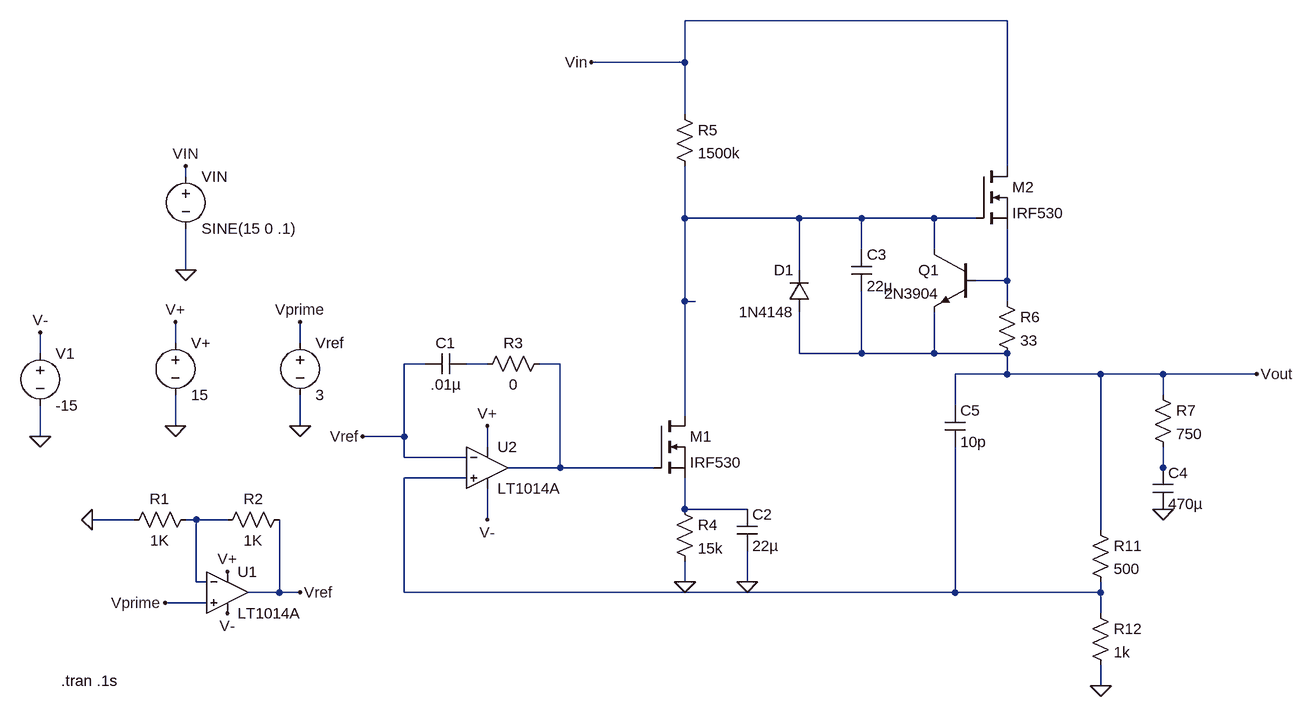
[diagram p0: schematic vregp.asc]
vregp.asc, the LTspice schematic file:
Version 4
SHEET 1 1328 1016
WIRE 816 -208 320 -208
WIRE 320 -144 320 -208
WIRE 320 -144 176 -144
WIRE 320 -64 320 -144
WIRE 816 16 816 -208
WIRE -448 32 -448 16
WIRE 320 96 320 16
WIRE 496 96 320 96
WIRE 592 96 496 96
WIRE 704 96 592 96
WIRE 768 96 704 96
WIRE 592 144 592 96
WIRE 704 144 704 96
WIRE -448 176 -448 112
WIRE 496 176 496 96
WIRE 816 192 816 112
WIRE 816 192 768 192
WIRE 320 224 320 96
WIRE 336 224 320 224
WIRE 816 224 816 192
WIRE -464 288 -464 256
WIRE -272 288 -272 256
WIRE -672 304 -672 272
WIRE 496 304 496 240
WIRE 592 304 592 208
WIRE 592 304 496 304
WIRE 704 304 704 240
WIRE 704 304 592 304
WIRE 816 304 704 304
WIRE -80 320 -112 320
WIRE 16 320 -16 320
WIRE 128 320 96 320
WIRE 816 336 816 304
WIRE 816 336 736 336
WIRE 960 336 816 336
WIRE 1056 336 960 336
WIRE 1200 336 1056 336
WIRE 1056 368 1056 336
WIRE 736 384 736 336
WIRE 320 400 320 224
WIRE -464 416 -464 368
WIRE -272 416 -272 368
WIRE -672 432 -672 384
WIRE -112 432 -112 320
WIRE -112 432 -176 432
WIRE 16 448 16 416
WIRE -112 464 -112 432
WIRE -16 464 -112 464
WIRE 128 480 128 320
WIRE 128 480 48 480
WIRE 272 480 128 480
WIRE 1056 480 1056 448
WIRE -16 496 -112 496
WIRE 1056 496 1056 480
WIRE 320 544 320 496
WIRE 416 544 320 544
WIRE -528 560 -592 560
WIRE -432 560 -448 560
WIRE -384 560 -432 560
WIRE 16 560 16 512
WIRE 960 576 960 336
WIRE -432 656 -432 560
WIRE -416 656 -432 656
WIRE 320 656 320 624
WIRE 416 656 416 608
WIRE -304 672 -304 560
WIRE -304 672 -352 672
WIRE -272 672 -304 672
WIRE -112 672 -112 496
WIRE 736 672 736 448
WIRE 736 672 -112 672
WIRE 960 672 960 656
WIRE 960 672 736 672
WIRE -416 688 -480 688
WIRE 960 704 960 672
WIRE 960 816 960 784
FLAG -464 416 0
FLAG -464 256 V+
FLAG -272 256 Vprime
FLAG -272 416 0
FLAG -448 176 0
FLAG -672 432 0
FLAG -672 272 V-
FLAG 960 816 0
FLAG 1056 544 0
FLAG 416 656 0
FLAG 320 656 0
FLAG 16 416 V+
FLAG -176 432 Vref
FLAG 176 -144 Vin
FLAG 1200 336 Vout
FLAG -448 16 VIN
FLAG -272 672 Vref
FLAG -480 688 Vprime
FLAG 16 560 V-
FLAG -384 640 V+
FLAG -384 704 V-
FLAG -592 560 0
SYMBOL voltage -448 16 R0
WINDOW 123 0 0 Left 2
WINDOW 39 0 0 Left 2
SYMATTR InstName VIN
SYMATTR Value SINE(15 0 .1)
SYMBOL voltage -464 272 R0
WINDOW 123 0 0 Left 2
WINDOW 39 0 0 Left 2
SYMATTR InstName V+
SYMATTR Value 15
SYMBOL voltage -272 272 R0
WINDOW 123 0 0 Left 2
WINDOW 39 0 0 Left 2
SYMATTR InstName Vref
SYMATTR Value 3
SYMBOL voltage -672 288 R0
WINDOW 123 0 0 Left 2
WINDOW 39 0 0 Left 2
SYMATTR InstName V1
SYMATTR Value -15
SYMBOL Opamps\\LT1014A 16 416 R0
SYMATTR InstName U2
SYMBOL cap -16 304 R90
WINDOW 0 0 32 VBottom 2
WINDOW 3 32 32 VTop 2
SYMATTR InstName C1
SYMATTR Value .01µ
SYMBOL res 112 304 R90
WINDOW 0 0 56 VBottom 2
WINDOW 3 32 56 VTop 2
SYMATTR InstName R3
SYMATTR Value 0
SYMBOL res 304 528 R0
SYMATTR InstName R4
SYMATTR Value 15k
SYMBOL cap 400 544 R0
SYMATTR InstName C2
SYMATTR Value 22µ
SYMBOL diode 512 240 R180
WINDOW 0 24 64 Left 2
WINDOW 3 24 0 Left 2
SYMATTR InstName D1
SYMATTR Value 1N4148
SYMBOL cap 576 144 R0
SYMATTR InstName C3
SYMATTR Value 22µ
SYMBOL npn 768 144 M0
SYMATTR InstName Q1
SYMATTR Value 2N3904
SYMBOL nmos 768 16 R0
SYMATTR InstName M2
SYMATTR Value IRF530
SYMBOL res 304 -80 R0
SYMATTR InstName R5
SYMATTR Value 1500k
SYMBOL res 800 208 R0
SYMATTR InstName R6
SYMATTR Value 33
SYMBOL res 1040 352 R0
SYMATTR InstName R7
SYMATTR Value 750
SYMBOL cap 1040 480 R0
SYMATTR InstName C4
SYMATTR Value 470µ
SYMBOL cap 720 384 R0
SYMATTR InstName C5
SYMATTR Value 10p
SYMBOL res 944 560 R0
SYMATTR InstName R11
SYMATTR Value 500
SYMBOL res 944 688 R0
SYMATTR InstName R12
SYMATTR Value 1k
SYMBOL Opamps\\LT1014A -384 608 R0
SYMATTR InstName U1
SYMBOL res -432 544 R90
WINDOW 0 0 56 VBottom 2
WINDOW 3 32 56 VTop 2
SYMATTR InstName R1
SYMATTR Value 1K
SYMBOL res -288 544 R90
WINDOW 0 0 56 VBottom 2
WINDOW 3 32 56 VTop 2
SYMATTR InstName R2
SYMATTR Value 1K
SYMBOL nmos 272 400 R0
SYMATTR InstName M1
SYMATTR Value IRF530
TEXT -640 808 Left 2 !.tran .1s

The netlist it stands for:
* vregp.asc
VIN Vin 0 SINE(15 0 .1)
V+ V+ 0 15
Vref Vprime 0 3
V1 V- 0 -15
XU2 N006 Vref V+ V- N004 LT1014A  ; pins In+ In- V+ V- OUT
C1 N003 Vref .01µ
R3 N004 N003 0
R4 N007 0 15k
C2 N007 0 22µ
D1 Vout N001 1N4148
C3 N001 Vout 22µ
Q1 N001 N002 Vout 0 2N3904
M2 Vin N001 N002 N002 IRF530
R5 Vin N001 1500k
R6 N002 Vout 33
R7 Vout N005 750
C4 N005 0 470µ
C5 Vout N006 10p
R11 Vout N006 500
R12 N006 0 1k
XU1 Vprime N008 V+ V- Vref LT1014A  ; pins In+ In- V+ V- OUT
R1 N008 0 1K
R2 Vref N008 1K
M1 N001 N004 N007 N007 IRF530
.model D D
.lib standard.dio
.model NPN NPN
.model PNP PNP
.lib standard.bjt
.model NMOS NMOS
.model PMOS PMOS
.lib standard.mos
.tran .1s
.backanno
.end